# Altium project nguon24v.PrjPcb
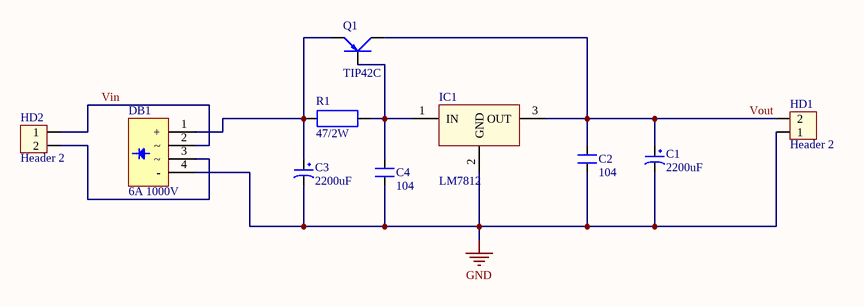
[diagram p0: nguon24v.SchDoc]
1 sheet, 10 parts. Net scope: global (net labels, ports and power ports of the same name join across sheets).
Board file: nguon24v.PcbDoc

## Sheet nguon24v.SchDoc
size A

### Parts
C1  2200uF  [CP1/2]
C2  104  [CN1.5]
C3  2200uF  [CP1/2]
C4  104  [CN1.5]
DB1  6A 1000V  [DIODE CAU 6A CAM]
HD1  Header 2  [HED2]
HD2  Header 2  [HED2]
IC1  LM7812  [QTO-220]
Q1  TIP42C  [QTO-220]
R1  47/2W  [R2W]

### Nets
GND: C1.2 C2.1 C3.2 C4.1 DB1.4(-) HD1.1 IC1.2(GND)
Vin: DB1.2 HD2.1
Vout: C1.1 C2.2 HD1.2 IC1.3(OUT) Q1.2(C)
NetC3_1: C3.1 DB1.1(+) Q1.3(E) R1.1
NetC4_2: C4.2 IC1.1(IN) Q1.1(B) R1.2
NetDB1_3: DB1.3 HD2.2

### Library data of the parts
C1 C3 = CP1: Cap P  0,1uF < 22uF , 16 - 50V; Value: 10uF/50V; Description 1: 10 => 220uF/6,3V/10V - 10uF => 100uF/16V; Description 2: 0,1uF => 33uF/50V - 10uF => 22uF/63V; Description 3: 0,47uF => 10uF/100V
C2 C4 = CN1.5: Cap np 682pF => 104pF; Value: 0.01uF
DB1 = Diode CAU 6A: Cắm; Ten_Linh_Kien: Diode Cầu 6A 1000V KBL610; Don_Vi: Con; Ma_Hang: MH004297; Ghi_Chu: *; Kieu_Chan: *; Chung_Loai: cắm
HD1 HD2 = Hed2: Header 2 (Green); Value: Header 2
IC1 = LM78xx: On ap +, from + 5 to + 24VDC; Value: LM7805
Q1 = TIP42C: PNP 2W, BCE; Value: TIP42C
R1 = R2W: Resistor 2W; Value: R2W - 47